# Altium schematic sheet Alimentation.SchDoc: Alimentation
size Letter; ApprovedBy: kc; Organization: Cegep Limoilou; Address1: 1300, 8e Avenue; Address2: Québec, QC; Address3: Canada; Address4: G1J 5L5; SheetNumber: 7; SheetTotal: 11
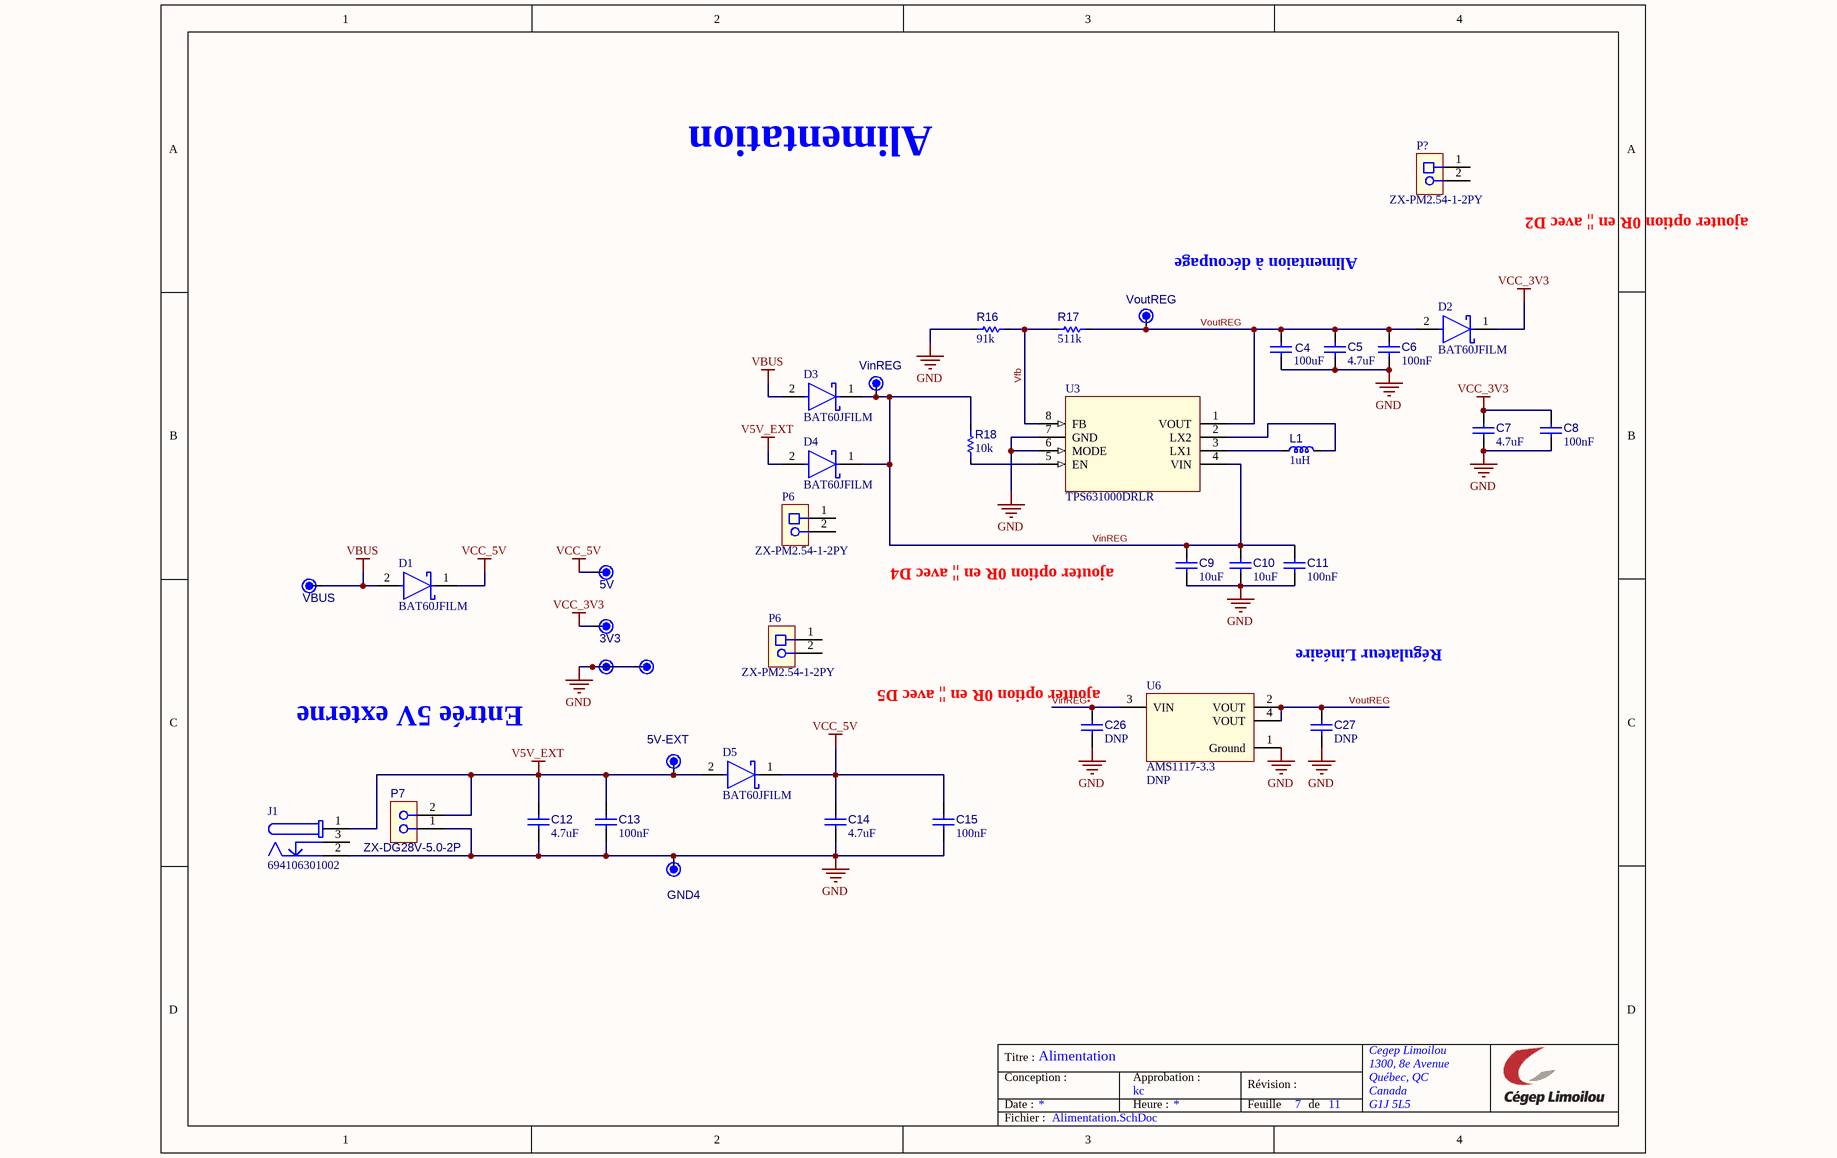
[diagram p0: Alimentation.SchDoc]

## Parts
(Parts that share a designator on the sheet are numbered #1, #2 ... from top to bottom, then left to right.)
3V3  DNP  [TP_TH061]  (value not drawn)  (no BOM)
5V  DNP  [TP_TH061]  (value not drawn)  (no BOM)
5V-EXT  DNP  [TP_TH061]  (value not drawn)  (no BOM)
C4  value 100uF  [C_3216[1206]]  (hidden comment: Cap 100uF 1206)
C5  value 4.7uF  [C_2012[0805]]  (hidden comment: Cap 4.7uF 0805)
C6  value 100nF  [C_1005[0402]]  (hidden comment: Cap 100nF 0402)
C7  value 4.7uF  [C_2012[0805]]  (hidden comment: Cap 4.7uF 0805)
C8  value 100nF  [C_1005[0402]]  (hidden comment: Cap 100nF 0402)
C9  value 10uF  [C_2012[0805]]  (hidden comment: CAP CER 10uF 25V X5R 0805)
C10  value 10uF  [C_2012[0805]]  (hidden comment: CAP CER 10uF 25V X5R 0805)
C11  value 100nF  [C_1005[0402]]  (hidden comment: Cap 100nF 0402)
C12  value 4.7uF  [C_2012[0805]]  (hidden comment: Cap 4.7uF 0805)
C13  value 100nF  [C_1005[0402]]  (hidden comment: Cap 100nF 0402)
C14  value 4.7uF  [C_2012[0805]]  (hidden comment: Cap 4.7uF 0805)
C15  value 100nF  [C_1005[0402]]  (hidden comment: Cap 100nF 0402)
C26  value DNP  [C_2012[0805]]  (hidden comment: CAP CER 10uF 25V X5R 0805)  (no BOM)
C27  value DNP  [C_2012[0805]]  (hidden comment: CAP CER 10uF 25V X5R 0805)  (no BOM)
D1  BAT60JFILM  [SOD323]
D2  BAT60JFILM  [SOD323]
D3  BAT60JFILM  [SOD323]
D4  BAT60JFILM  [SOD323]
D5  BAT60JFILM  [SOD323]
GND1  GND  [TP_TH061]  (value not drawn)  (no BOM)
GND2  GND  [TP_TH061]  (value not drawn)  (no BOM)
GND4  GND  [TP_TH061]  (value not drawn)  (no BOM)
J1  694106301002  [CONN_DC-JACK_RA]
L1  value 1uH  [L_3030[1212]]  (hidden comment: Ind 1UH 2.75A 51mOHM SMD)
P6#1  ZX-PM2.54-1-2PY  [CONN_SKT_2POS_100MILS_TH]
P6#2  ZX-PM2.54-1-2PY  [CONN_SKT_2POS_100MILS_TH]
P7  ZX-DG28V-5.0-2P  [CONN_TERM_BLOCK_2POS_5mm_Model1]
P?  ZX-PM2.54-1-2PY  [CONN_SKT_2POS_100MILS_TH]
R16  value 91k  [R_1005[0402]]  (hidden comment: Res 91k 1% 0402)
R17  value 511k  [R_1005[0402]]  (hidden comment: Res 511k 1% 0402)
R18  value 10k  [R_1005[0402]]  (hidden comment: Res 10k 1% 0402)
U3  TPS631000DRLR  [U_SOT583_50P210X120X60-8]
U6  AMS1117-3.3  value DNP  [SOT-223]  (no BOM)
VBUS  DNP  [TP_TH061]  (value not drawn)  (no BOM)
VinREG  DNP  [TP_TH061]  (value not drawn)  (no BOM)
VoutREG  DNP  [TP_TH061]  (value not drawn)  (no BOM)

## Nets
GND: C4.1 C5.1 C6.1 C7.1 C8.1 C9.1 C10.1 C11.1 C12.1 C13.1 C14.1 C15.1 C26.1 C27.1 GND1.1 GND2.1 GND4.1 J1.2 P7.1 R16.1 U3.6(MODE) U3.7(GND) U6.1(Ground)
V5V_EXT: 5V-EXT.1 C12.2 C13.2 D4.2(A) D5.2(A) J1.1 P7.2
VBUS: D1.2(A) D3.2(A) VBUS.1
VCC_3V3: 3V3.1 C7.2 C8.2 D2.1(K)
VCC_5V: 5V.1 C14.2 C15.2 D1.1(K) D5.1(K)
Vfb: R16.2 R17.1 U3.8(FB)
VinREG: C9.2 C10.2 C11.2 C26.2 D3.1(K) D4.1(K) R18.2 U3.4(VIN) U6.3(VIN) VinREG.1
VoutREG: C4.2 C5.2 C6.2 C27.2 D2.2(A) R17.2 U3.1(VOUT) U6.2(VOUT) U6.4(VOUT) VoutREG.1
NetL1_1: L1.1 U3.3(LX1)
NetL1_2: L1.2 U3.2(LX2)
NetR18_1: R18.1 U3.5(EN)

Not connected (* = marked no-connect by the designer): J1 3; P6#1 1 2; P6#2 1 2; P? 1 2

## Notes on the sheet
- (near P?) ajouter option 0R en || avec D2
- Alimentaion à découpage
- (near 5V) ajouter option 0R en || avec D4
- ajouter option 0R en || avec D5
- Régulateur Linéaire
- Entrée 5V externe
- Titre :
- Conception :
- Date :
- Approbation :
- Heure :
- Révision :
- Feuille
- de
- Fichier :

## Library data of the parts
3V3 5V 5V-EXT VBUS VinREG VoutREG = TP_TH0.61mm(AWG28): Pad TH 0.61mm diameter (AWG28); Value: DNP; Manufacturer Part Number 1: DNP; Supplier Part Number 1: N/A; Supplier 1: N/A
C4 = CAP005: Capacitor type 1; Manufacturer 1: Murata; Manufacturer Part Number 1: GRM31CR61A107MEA8L; LibRef: CAP005; CEGEP: KCOND04SM; Tolerance: 20%; Rated Voltage: 10V; Dielectric: X5R; Supplier 1: LCSC; Supplier Part Number 1: C883598; Mounting Technology: SMT
C5 C7 C12 C14 = CAP003: Capacitor type 1; Manufacturer 1: Taiyo Yuden; Manufacturer Part Number 1: TMK212AB7475KG-T; LibRef: CAP003; CEGEP: KCOND02SM; Tolerance: 10%; Rated Voltage: 25V; Dielectric: X7R; Supplier 1: LCSC; Supplier Part Number 1: C163186; Mounting Technology: SMT
C6 C8 C11 C13 C15 = CAP001: Capacitor type 1; Manufacturer 1: Taiyo Yuden; Manufacturer Part Number 1: UMK105B7104KV-FR; LibRef: CAP001; CEGEP: KCOND01SM; Tolerance: 10%; Rated Voltage: 50V; Dielectric: X7R; Mounting Technology: SMT; Supplier 1: LCSC; Supplier Part Number 1: C2167491
C9 C10 C26 C27 = CAP020: Capacitor type 1; Manufacturer 1: Samsung; Manufacturer Part Number 1: CL21A106KAYNNNE; LibRef: CAP020; Tolerance: 10%; Rated Voltage: 25V; Dielectric: X5R; Mounting Technology: SMT; Supplier 1: LCSC; Supplier Part Number 1: C15850
D1-D5 = D_BAT60: DIODE SCHOTTKY 10V 3A SOD323; Manufacturer 1: ST; Manufacturer Part Number 1: BAT60JFILM; Mounting Technology: SMT; Supplier 1: LCSC; Supplier Part Number 1: C133103
GND1 GND2 GND4 = TP_TH0.61mm(AWG28): Pad TH 0.61mm diameter (AWG28); Value: DNP; Manufacturer Part Number 1: DNP; Supplier Part Number 1: N/A; Supplier 1: N/A
J1 = CONN-DC-JACK-2MM5: DC Barrel Connector 2.5mm; Manufacturer 1: XKB Connection; Manufacturer Part Number 1: DC-005-5A-2.5; Mounting Technology: TH; Supplier 1: LCSC; Supplier Part Number 1: C381115
L1 = IND001: Inductor type 1; Manufacturer 1: Murata Electronics; Manufacturer Part Number 1: LQH3NPN1R0MMEL; LibRef: IND001; CEGEP: KPTSO09; Tolerance: 0,2; DCR: 0.025R; Saturation Current: 2.3A; Supplier 1: LCSC; Supplier Part Number 1: C703777; Mounting Technology: SMT
P6#1 P6#2 P? = CONN-100MIL-SKT-01X02: CONN SOCKET 2pins single row , 100mils TH; Manufacturer 1: Megastar; Manufacturer Part Number 1: ZX-PM2.54-1-2PY; Mounting Technology: TH; Supplier 1: LCSC; Supplier Part Number 1: C7499322; Manufacturer 2: Würth Elektronik; Manufacturer Part Number 2: 61300211121
P7 = CONN-5MM-2POS-TERM-BLOCK: CONN TERM BLOCK 2POS 5mm pitch; Manufacturer 1: Megastar; Code CEGEP: CONWECO0002; Supplier 1: LCSC; Supplier Part Number 1: C49022995; Manufacturer Part Number 1: ZX-DG28V-5.0-2P; Mounting Technology: TH; Manufacturer 2: Weidmüller - Phoenix Contact; Manufacturer Part Number 2: 1760510000 - 1890963
R16 = RES011: Resistor type 1; Manufacturer 1: Yageo; Manufacturer Part Number 1: RC0402FR-0791KL; LibRef: RES011; Code CEGEP: RES91KSM; Puissance: 1/16W; Max Working Voltage: 50V; Tolerance: 1%; Mounting Technology: SMT; Supplier 1: LCSC; Supplier Part Number 1: C327323
R17 = RES012: Resistor type 1; Manufacturer 1: Yageo; Manufacturer Part Number 1: RC0402FR-07511KL; LibRef: RES012; Code CEGEP: RES511KSM; Puissance: 1/16W; Max Working Voltage: 50V; Tolerance: 1%; Mounting Technology: SMT; Supplier 1: LCSC; Supplier Part Number 1: C163461
R18 = RES003: Resistor type 1; Manufacturer 1: Vishay; Manufacturer Part Number 1: CR0402F1002T1LF; LibRef: RES003; Puissance: 1/16W; Max Working Voltage: 50V; Tolerance: 1%; Mounting Technology: SMT; Supplier 1: Digikey; Supplier Part Number 1: 541-10.0KLCT-ND
U3 = U_TPS631000DRLR: buck-boost converter 1.5-A output current,; Manufacturer 1: Texas Instruments; Manufacturer Part Number 1: TPS631000DRLR; Supplier 1: LCSC; Supplier 2: Digikey; Supplier Part Number 1: C5219190; Supplier Part Number 2: 296-TPS631000DRLRCT-ND; Mounting Technology: SMT
U6 = U_AMS1117-3.3: LDO Voltage Regulators 1A, 3.3V; Manufacturer 1: UMW; Manufacturer Part Number 1: AMS1117-3.3; Mounting Technology: SMT; Manufacturer 2: Advanced Monolithic Systems; Manufacturer Part Number 2: AMS1117-3.3; Supplier 1: LCSC; Supplier 2: LCSC; Supplier Part Number 1: C347222; Supplier Part Number 2: C6186